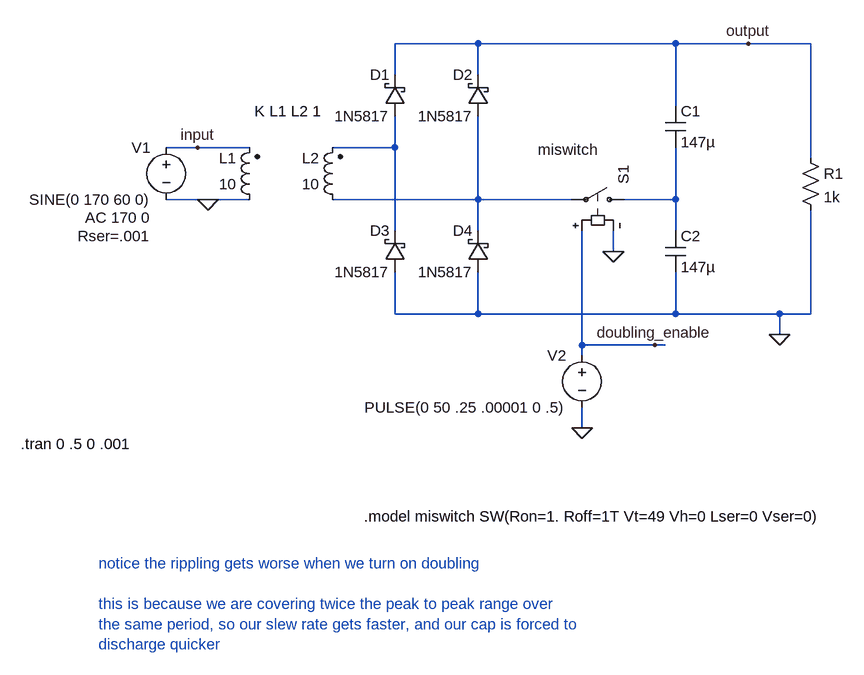
[diagram p0: schematic voltage_doubler.asc]
voltage_doubler.asc, the LTspice schematic file:
Version 4
SHEET 1 1172 912
WIRE 528 -16 400 -16
WIRE 832 -16 528 -16
WIRE 944 -16 832 -16
WIRE 1040 -16 944 -16
WIRE 400 32 400 -16
WIRE 528 32 528 -16
WIRE 832 80 832 -16
WIRE 96 144 48 144
WIRE 176 144 96 144
WIRE 400 144 400 96
WIRE 400 144 304 144
WIRE 1040 160 1040 -16
WIRE 112 224 48 224
WIRE 176 224 112 224
WIRE 528 224 528 96
WIRE 528 224 304 224
WIRE 672 224 528 224
WIRE 832 224 832 144
WIRE 832 224 752 224
WIRE 400 272 400 144
WIRE 528 272 528 224
WIRE 832 272 832 224
WIRE 736 304 736 272
WIRE 400 400 400 336
WIRE 528 400 528 336
WIRE 528 400 400 400
WIRE 832 400 832 336
WIRE 832 400 528 400
WIRE 992 400 832 400
WIRE 1040 400 1040 240
WIRE 1040 400 992 400
WIRE 992 432 992 400
WIRE 688 448 688 272
WIRE 800 448 688 448
WIRE 816 448 800 448
WIRE 688 464 688 448
WIRE 688 576 688 544
FLAG 736 304 0
FLAG 688 576 0
FLAG 800 448 doubling_enable
FLAG 112 224 0
FLAG 992 432 0
FLAG 96 144 input
FLAG 944 -16 output
SYMBOL voltage 48 128 M0
WINDOW 123 24 124 Left 2
WINDOW 39 24 152 Left 2
SYMATTR InstName V1
SYMATTR Value SINE(0 170 60 0)
SYMATTR Value2 AC 170 0
SYMATTR SpiceLine Rser=.001
SYMBOL ind2 192 240 R180
WINDOW 0 36 80 Left 2
WINDOW 3 36 40 Left 2
SYMATTR InstName L1
SYMATTR Value 10
SYMATTR Type ind
SYMBOL ind2 320 240 R180
WINDOW 0 36 80 Left 2
WINDOW 3 36 40 Left 2
SYMATTR InstName L2
SYMATTR Value 10
SYMATTR Type ind
SYMBOL schottky 416 96 R180
WINDOW 0 24 64 Left 2
WINDOW 3 24 0 Left 2
SYMATTR InstName D1
SYMATTR Value 1N5817
SYMATTR Description Diode
SYMATTR Type diode
SYMBOL cap 816 80 R0
SYMATTR InstName C1
SYMATTR Value 147µ
SYMBOL cap 816 272 R0
SYMATTR InstName C2
SYMATTR Value 147µ
SYMBOL res 1024 144 R0
SYMATTR InstName R1
SYMATTR Value 1k
SYMBOL voltage 688 448 M0
WINDOW 123 24 124 Left 2
WINDOW 39 24 152 Left 2
SYMATTR InstName V2
SYMATTR Value PULSE(0 50 .25 .00001 0 .5)
SYMBOL schottky 544 96 R180
WINDOW 0 24 64 Left 2
WINDOW 3 24 0 Left 2
SYMATTR InstName D2
SYMATTR Value 1N5817
SYMATTR Description Diode
SYMATTR Type diode
SYMBOL schottky 416 336 R180
WINDOW 0 24 64 Left 2
WINDOW 3 24 0 Left 2
SYMATTR InstName D3
SYMATTR Value 1N5817
SYMATTR Description Diode
SYMATTR Type diode
SYMBOL schottky 544 336 R180
WINDOW 0 24 64 Left 2
WINDOW 3 24 0 Left 2
SYMATTR InstName D4
SYMATTR Value 1N5817
SYMATTR Description Diode
SYMATTR Type diode
SYMBOL sw 768 224 M270
WINDOW 3 77 148 VLeft 2
SYMATTR InstName S1
SYMATTR Value miswitch
TEXT 184 88 Left 2 !K L1 L2 1
TEXT -176 600 Left 2 !.tran 0 .5 0 .001
TEXT 352 712 Left 2 !.model miswitch SW(Ron=1. Roff=1T Vt=49 Vh=0 Lser=0 Vser=0)
TEXT -56 784 Left 2 ;notice the rippling gets worse when we turn on doubling\n \nthis is because we are covering twice the peak to peak range over \nthe same period, so our slew rate gets faster, and our cap is forced to\ndischarge quicker

The netlist it stands for:
* voltage_doubler.asc
V1 input 0 SINE(0 170 60 0) AC 170 0 Rser=.001
L1 0 input 10
L2 N002 N001 10
D1 N001 output 1N5817
C1 output N003 147µ
C2 N003 0 147µ
R1 output 0 1k
V2 doubling_enable 0 PULSE(0 50 .25 .00001 0 .5)
D2 N002 output 1N5817
D3 0 N001 1N5817
D4 0 N002 1N5817
S1 N003 N002 doubling_enable 0 miswitch
.model D D
.lib standard.dio
K L1 L2 1
.tran 0 .5 0 .001
.model miswitch SW(Ron=1. Roff=1T Vt=49 Vh=0 Lser=0 Vser=0)
* notice the rippling gets worse when we turn on doubling
* this is because we are covering twice the peak to peak range over
* the same period, so our slew rate gets faster, and our cap is forced to
* discharge quicker
.backanno
.end